# Altium project SiLPA_HE.PrjPCB (part 3 of 7)

## Sheet SiLPA_HE_RF_channel.SchDoc: SiLPA HE
size 420 x 297 mm; EDA_Number: ARTIQ; Projet: Sampler; Author: S.Hanasz / G. Kasprowicz; CompanyName: WUT ISE; DrawnBy: S.Hanasz / G. Kasprowicz; Organization: WUT ISE; Address1: PW ISE; Address2: Nowowiejska 15/19 00-665 Warsaw; Address3: gkasprow@gmail.com; DocumentNumber: 3; Revision: 1; SheetNumber: 3; SheetTotal: 9; ModifiedBy: -; CheckedDate: -; Title2: Power stage; DivGrp: WUT ISE; Designer: S.Hanasz / G. Kasprowicz; ModifiedDate: -; ProjectName: Sensor Box
Used 2 times, as channels U_SiLPA_RF_channel0, U_SiLPA_RF_channel1. Parts and nets are listed once, with the designators drawn on the sheet.
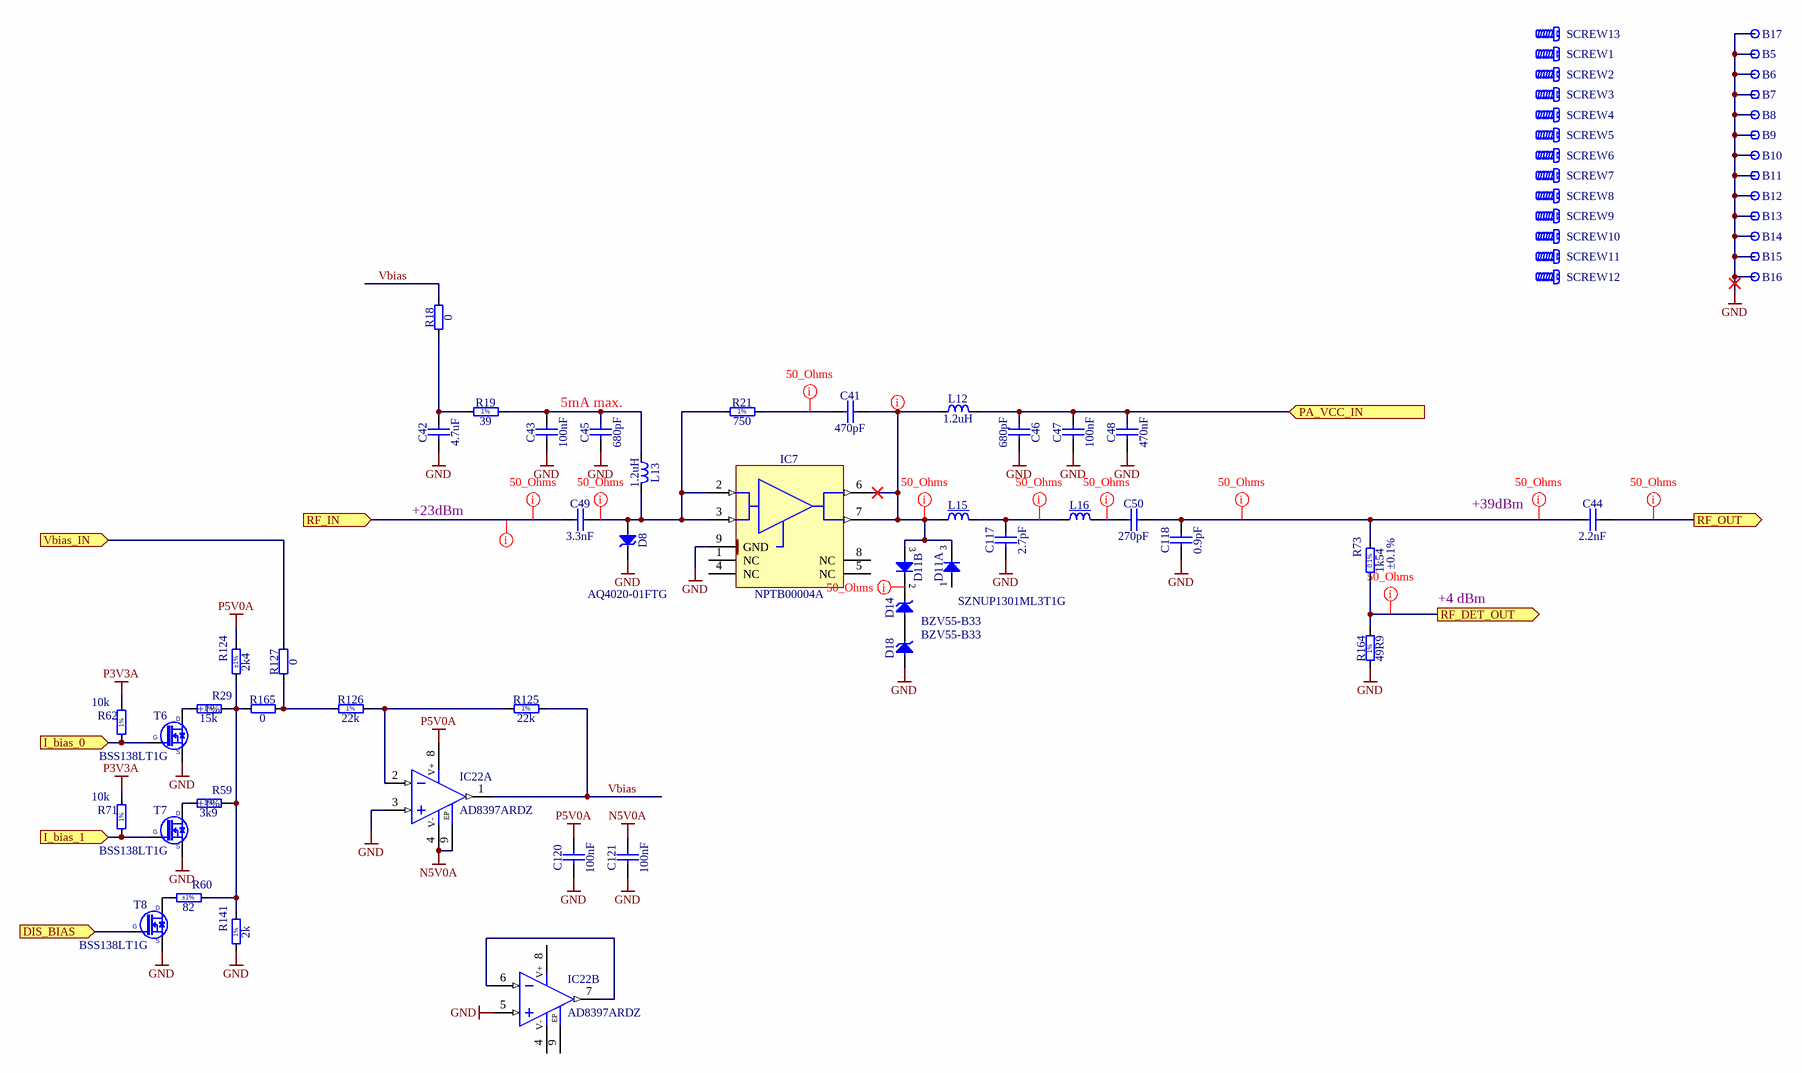
[diagram p3: SiLPA_HE_RF_channel.SchDoc]

### Parts
B5  Plated Hole  [MTG240_400]  (value not drawn)  (no BOM)
B6  Plated Hole  [MTG240_400]  (value not drawn)  (no BOM)
B7  Plated Hole  [MTG240_400]  (value not drawn)  (no BOM)
B8  Plated Hole  [MTG240_400]  (value not drawn)  (no BOM)
B9  Plated Hole  [MTG240_400]  (value not drawn)  (no BOM)
B10  Plated Hole  [MTG240_400]  (value not drawn)  (no BOM)
B11  Plated Hole  [MTG240_400]  (value not drawn)  (no BOM)
B12  Plated Hole  [MTG240_400]  (value not drawn)  (no BOM)
B13  Plated Hole  [MTG240_400]  (value not drawn)  (no BOM)
B14  Plated Hole  [MTG240_400]  (value not drawn)  (no BOM)
B15  Plated Hole  [MTG240_400]  (value not drawn)  (no BOM)
B16  Plated Hole  [MTG240_400]  (value not drawn)  (no BOM)
B17  Plated Hole  [MTG240_400]  (value not drawn)  (no BOM)
C41  470pF  [CAPC1608X87N]
C42  4.7uF  [CAPC1709X95N]
C43  100nF  [CAPC1005X55N]
C44  2.2nF  [CAPC1608X87N]
C45  680pF  [CAPC1005X55N]
C46  680pF  [CAPC1608X87N]
C47  100nF  [CAPC1005X55N]
C48  470nF  [CAPC2012X110N]
C49  3.3nF  [CAPC1608X87N]
C50  270pF  [CAPC1608X87N]
C117  2.7pF  [CAPC1608X87N]
C118  0.9pF  [CAPC1608X87N]
C120  100nF  [CAPC1005X55N]
C121  100nF  [CAPC1005X55N]
D8  AQ4020-01FTG  [SOD2512X110N]
D11  SZNUP1301ML3T1G  [SOT95P240X110-3N]  (value not drawn)  (parts A,B of 2)
D14  BZV55-B33  [DIOMELF3515N]
D18  BZV55-B33  [DIOMELF3515N]
IC7  NPTB00004A  [SOIC127P610X167-9N-R245X335]
IC22  AD8397ARDZ  [SOIC127P600X175-9N-R241X309]  (parts A,B of 2)
L12  1.2uH  [IND_TDK_ADL2012]
L13  1.2uH  [IND_TDK_ADL2012]
L15  (no value)  [IND_MURATA_LQW18AN_G8]
L16  (no value)  [IND_MURATA_LQW18AN_G8]
R18  0  [RESC1005X40N]
R19  39  [RESC1005X40N]
R21  750  [RESC1608X55N]
R29  15k  Tolerance: ±1%  [RESC1005X40N]
R59  3k9  Tolerance: ±1%  [RESC1005X40N]
R60  82  Tolerance: ±1%  [RESC1005X40N]
R62  10k  [RESC1005X40N]
R71  10k  [RESC1005X40N]
R73  1k54  Tolerance: ±0.1%  [RESC2012X60N]
R124  2k4  Tolerance: ±1%  [RESC1005X40N]
R125  22k  [RESC1005X40N]
R126  22k  [RESC1005X40N]
R127  0  [RESC1005X40N]
R141  2k  [RESC1005X40N]
R164  49R9  [RESC1608X55N]
R165  0  [RESC1005X40N]
SCREW1  (no value)  [BOSSARD_BN5687-3061579_v]
SCREW2  (no value)  [BOSSARD_BN5687-3061579_v]
SCREW3  (no value)  [BOSSARD_BN5687-3061579_v]
SCREW4  (no value)  [BOSSARD_BN5687-3061579_v]
SCREW5  (no value)  [BOSSARD_BN5687-3061579_v]
SCREW6  (no value)  [BOSSARD_BN5687-3061579_v]
SCREW7  (no value)  [BOSSARD_BN5687-3061579_v]
SCREW8  (no value)  [BOSSARD_BN5687-3061579_v]
SCREW9  (no value)  [BOSSARD_BN5687-3061579_v]
SCREW10  (no value)  [BOSSARD_BN5687-3061579_v]
SCREW11  (no value)  [BOSSARD_BN5687-3061579_v]
SCREW12  (no value)  [BOSSARD_BN5687-3061579_v]
SCREW13  (no value)  [BOSSARD_BN5687-3061579_v]
T6  BSS138LT1G  [SOT95P240X110-3N]
T7  BSS138LT1G  [SOT95P240X110-3N]
T8  BSS138LT1G  [SOT95P240X110-3N]

### Ports
DIS_BIAS (in), I_bias_0 (in), I_bias_1 (in), PA_VCC_IN (in), RF_DET_OUT (out), RF_IN (in), RF_OUT (out), Vbias_IN (in)

### Nets
GND: B5.1 B6.1 B7.1 B8.1 B9.1 B10.1 B11.1 B12.1 B13.1 B14.1 B15.1 B16.1 B17.1 C42.1 C43.1 C45.1 C46.1 C47.1 C48.1 C117.1 C118.1 C120.1 C121.1 D8.1(C) D18.2(A) IC7.9(GND) IC22.3(IN+) IC22.5(IN+) R141.1 R164.1 T6.2(S) T7.2(S) T8.2(S)
N5V0A: C121.2 IC22.4(V-) IC22.9(Exposed_Pad)
P3V3A: R62.2 R71.2
P5V0A: C120.2 IC22.8(V+) R124.2
DIS_BIAS: T8.1(G) ; port DIS_BIAS
I_bias_0: R62.1 T6.1(G) ; port I_bias_0
I_bias_1: R71.1 T7.1(G) ; port I_bias_1
PA_VCC_IN: C46.2 C47.2 C48.2 L12.2 ; port PA_VCC_IN
RF_DET_OUT: R73.1 R164.2 ; port RF_DET_OUT
RF_IN: C49.2 ; port RF_IN
RF_OUT: C44.2 ; port RF_OUT
Vbias: IC22.1(OUT) R18.2 R125.1
Vbias_IN: R127.2 ; port Vbias_IN
NetC41_1: C41.1 R21.2
NetC41_2: C41.2 D11.3(COMAC) IC7.6(RF_OUT) IC7.7(RF_OUT) L12.1 L15.1
NetC42_2: C42.2 R18.1 R19.1
NetC43_2: C43.2 C45.2 L13.1 R19.2
NetC44_1: C44.1 C50.2 C118.2 R73.2
NetC49_1: C49.1 D8.2(A) IC7.2(RF_IN) IC7.3(RF_IN) L13.2 R21.1
NetC50_1: C50.1 L16.2
NetC117_2: C117.2 L15.2 L16.1
NetD11_2: D11.2(C) D14.1(C)
NetD14_2: D14.2(A) D18.1(C)
NetIC22_2: IC22.2(IN-) R125.2 R126.1
NetIC22_6: IC22.6(IN-) IC22.7(OUT)
NetR29_1: R29.1 T6.3(D)
NetR29_2: R29.2 R59.2 R60.2 R124.1 R141.2 R165.1
NetR59_1: R59.1 T7.3(D)
NetR60_1: R60.1 T8.3(D)
NetR126_2: R126.2 R127.1 R165.2

Not connected (* = marked no-connect by the designer): D11 1(A); IC7 1(NC) 4(NC) 5(NC) 8(NC)

### Channels
U_SiLPA_RF_channel0: designators end in A; ports DIS_BIAS=NetIC24A_1 I_bias_0=I_bias0_0 I_bias_1=I_bias0_1 PA_VCC_IN=P25V0_0 RF_DET_OUT=NetC52A_1 RF_IN=NetC16A_2 RF_OUT=NetC44A_2 Vbias_IN=VBIAS_CTRL1
U_SiLPA_RF_channel1: designators end in B; ports DIS_BIAS=NetIC24A_1 I_bias_0=I_bias1_0 I_bias_1=I_bias1_1 PA_VCC_IN=P25V0_1 RF_DET_OUT=NetC52B_1 RF_IN=NetC16B_2 RF_OUT=NetC44B_2 Vbias_IN=VBIAS_CTRL2

### Layout directives
net class 50_Ohms: NetC16A_2, NetC41A_1, NetC41A_2, NetC44A_1, NetC44A_2, NetC49A_1, NetC50A_1, NetC52A_1, NetC117A_2, NetD11A_2
net class 50_Ohm: NetC16A_2, NetC41A_2

### Notes on the sheet
- 5mA max.
- +23dBm
- +39dBm
- +4 dBm
- Project/Equipment
- Document
- Designer
- Drawn by
- Check.by
- Copyright WUT ISE 2018.
  This documentation describes Open Hardware and is licensed under the CERN OHL v.1.1. You may redistribute and modify this documentation under the terms of the CERN OHL v.1.1. (http://ohwr.org/CERNOHL). This documentation is distributed WITHOUT ANY EXPRESS OR IMPLIED WARRANTY, INCLUDING OF MERCHANTABILITY, SATISFACTORY QUALITY AND FITNESS FOR A PARTICULAR PURPOSE. Please see the CERN OHL v.1.1 for applicable conditions.
- Contact
- File
- Last Mod.
- Print Date
- Sheet
- Size
- A3
- of
- Rev
- (in symbol AD8397ARDZ, part A) EP
- (in symbol AD8397ARDZ, part B) EP
- (in symbol R0402_2K_1%_0.0625W_100PPM) 1%
- (in symbol R0402_3K9_1%_0.0625W_100PPM) 1%
- (in symbol R0402_10K_1%_0.0625W_100PPM) 1%
- (in symbol R0402_15K_1%_0.0625W_100PPM) 1%
- (in symbol R0402_22K_1%_0.0625W_100PPM) 1%
- (in symbol R0402_39R_1%_0.0625W_100PPM) 1%
- (in symbol R0603_49K9_1%_0.1W_100PPM) 1%
- (in symbol R0603_750R_1%_0.1W_100PPM) 1%
- (in symbol R0805_1K54_0.1%_0.1W_10PPM) 0.1%

### Library data of the parts
B5-B17 = PLATED_HOLE2.4_PAD4.0: Single Terminal Socket; Part Description: Plated Through Hole: Hole Dia.=2.4mm Pad Dia.=4.0mm; Mounted: No; Part Number: PLATED_HOLE2.4_PAD4.0; Component Type: Standard (No BOM); Pin Count: 1; Family: Plated Hole; Socket: No; SMD: No; Status: None; ComponentHeight: 0mm; Author: CERN DEM JMW; CreateDate: 10.10.2011; LatestRevisionDate: 10.10.2011; PackageDescription: Plated Through Hole: Hole Dia.=2.4mm Pad Dia.=4.0mm; Sense: No; HelpURL: Undefined
C41 = CC0603_470PF_50V_1%_NP0: Non-polarised capacitor; Part Description: SMD Multilayer Chip Ceramic Capacitor; Manufacturer: GENERIC; Manufacturer1 Part Number: MCMT18N471F500CT; Voltage: 50V; TC: C0G/NP0; Tolerance: ±1%; Part Number: CC0603_470PF_50V_1%_NP0; Component Kind: Standard; Component Type: Standard; Pin Count: 2; Value: 470pF; Status: Preferred; Manufacturer Part Number: CC0603_470PF_50V_1%_NP0; Case: 0603; Mounted: Yes; Socket: No; SMD: Yes; Sense: No; Manufacturer1 Example: Multicomp; Manufacturer1 ComponentHeight: 0.87mm; HelpURL: \\cern.ch\dfs\Applications\Altium\Datasheets\CC0603_NP0_PHYCOMP.pdf; Author: GK; CreateDate: 03.12.2007; LatestRevisionDate: 03.12.2007
C42 = CC0603_4.7UF_16V_10%_X5R: Non-polarised capacitor; Manufacturer: GENERIC; Part Description: SMD Multilayer Chip Ceramic Capacitor; Manufacturer1 Part Number: EMK107ABJ475KA-T; Voltage: 16V; TC: X5R; Tolerance: ±10%; Value: 4.7uF; Manufacturer Part Number: CC0603_4.7UF_16V_10%_X5R; Part Number: CC0603_4.7UF_16V_10%_X5R; Component Kind: Standard; Component Type: Standard; Pin Count: 2; Status: None; Case: 0603; Mounted: Yes; Socket: No; SMD: Yes; Sense: No; Manufacturer1 Example: TAIYO YUDEN; Manufacturer1 ComponentHeight: 0.95mm; HelpURL: \\cern.ch\dfs\Applications\Altium\Datasheets\CC0603_X7R_TAIYO-YUDEN_HIGH-VALUE.pdf; Author: CERN DEM JLC; CreateDate: 16.12.2013; LatestRevisionDate: 16.09.2014
C43 C47 = CC0402_100NF_50V_10%_X7R: Non-polarised capacitor; Manufacturer: GENERIC; Part Description: SMD Multilayer Chip Ceramic Capacitor; Manufacturer1 Part Number: GRM155R71H104KE14D; Voltage: 50V; TC: X7R; Tolerance: ±10%; Value: 100nF; Manufacturer Part Number: CC0402_100NF_50V_10%_X7R; Part Number: CC0402_100NF_50V_10%_X7R; Component Kind: Standard; Component Type: Standard; Pin Count: 2; Status: None; Case: 0402; Mounted: Yes; Socket: No; SMD: Yes; Sense: No; Manufacturer1 Example: MURATA; Manufacturer1 ComponentHeight: 0.55mm; HelpURL: \\cern.ch\dfs\Applications\Altium\Datasheets\CC0402_MURATA_GRM155R71H104KE14D.pdf; Author: CERN DEM MR; CreateDate: 30/06/2017; LatestRevisionDate: 30/06/2017
C44 = CC0603_2.2NF_50V_5%_C0G: Non-polarised capacitor; Manufacturer: GENERIC; Part Description: SMD Multilayer Chip Ceramic Capacitor; Manufacturer1 Part Number: C1608C0G1H222J080AA; Voltage: 50V; TC: C0G/NP0; Tolerance: ±5%; Value: 2.2nF; Manufacturer Part Number: CC0603_2.2NF_50V_5%_C0G; Part Number: CC0603_2.2NF_50V_5%_C0G; Component Kind: Standard; Component Type: Standard; Pin Count: 2; Status: Preferred; Case: 0603; Mounted: Yes; Socket: No; SMD: Yes; Sense: No; Manufacturer1 Example: TDK; Manufacturer1 ComponentHeight: 0.9mm; HelpURL: \\cern.ch\dfs\Applications\Altium\Datasheets\CC0603_C0G_TDK_C.pdf; Author: CERN DEM JMW; CreateDate: 23.06.2014; LatestRevisionDate: 23.06.2014
C45 = CC0402_680PF_50V_5%_X7R: Non-polarised capacitor; Manufacturer: GENERIC; Manufacturer Part Number: CC0402_680PF_50V_10%_X7R; Part Description: SMD Multilayer Chip Ceramic Capacitor; Manufacturer1 Part Number: 223858715621; Voltage: 50V; TC: X7R; Tolerance: ±10%; Value: 680pF; Part Number: CC0402_680PF_50V_5%_X7R; Component Kind: Standard; Component Type: Standard; Pin Count: 2; Status: Not Recommended; Case: 0402; Mounted: Yes; Socket: No; SMD: Yes; Sense: No; Manufacturer1 Example: PHYCOMP; Manufacturer1 ComponentHeight: 0.55mm; HelpURL: \\cern.ch\dfs\Applications\Altium\Datasheets\CC0402_NP0_PHYCOMP.pdf; Author: CERN DEM JLC; CreateDate: 03.12.2007; LatestRevisionDate: 03.12.2007
C46 = CC0603_680PF_50V_5%_NP0: Non-polarised capacitor; Manufacturer: GENERIC; Part Description: SMD Multilayer Chip Ceramic Capacitor; Manufacturer1 Part Number: 223886715681; Voltage: 50V; TC: C0G/NP0; Tolerance: ±5%; Value: 680pF; Manufacturer Part Number: CC0603_680PF_50V_5%_NP0; Part Number: CC0603_680PF_50V_5%_NP0; Component Kind: Standard; Component Type: Standard; Pin Count: 2; Status: Preferred; Case: 0603; Mounted: Yes; Socket: No; SMD: Yes; Sense: No; Manufacturer1 Example: PHYCOMP; Manufacturer1 ComponentHeight: 0.87mm; HelpURL: \\cern.ch\dfs\Applications\Altium\Datasheets\CC0603_NP0_PHYCOMP.pdf; Author: CERN DEM JLC; CreateDate: 03.12.2007; LatestRevisionDate: 03.12.2007
C48 = CC0805_470NF_50V_10%_X7R: Non-polarised capacitor; Part Description: SMD Multilayer Chip Ceramic Capacitor; Manufacturer: GENERIC; Manufacturer1 Part Number: C0805C474K5RACTU; Voltage: 50V; TC: X7R; Tolerance: ±10%; Part Number: CC0805_470NF_50V_10%_X7R; Component Kind: Standard; Component Type: Standard; Pin Count: 2; Value: 470nF; Status: Preferred; Manufacturer Part Number: CC0805_470NF_50V_10%_X7R; Case: 0805; Mounted: Yes; Socket: No; SMD: Yes; Sense: No; Manufacturer1 Example: KEMET; Manufacturer1 ComponentHeight: 1.1mm; HelpURL: \\cern.ch\dfs\Applications\Altium\Datasheets\CC0805_X7R_KEMET.pdf; Author: CERN DEM JLC; CreateDate: 04.12.2013; LatestRevisionDate: 04.12.2013
C49 = CC0603_3.3NF_50V_5%_C0G: Non-polarised capacitor; Manufacturer: GENERIC; Part Description: SMD Multilayer Chip Ceramic Capacitor; Manufacturer1 Part Number: C1608C0G1H332J080AA; Voltage: 50V; TC: C0G/NP0; Tolerance: ±5%; Value: 3.3nF; Manufacturer Part Number: CC0603_3.3NF_50V_5%_C0G; Part Number: CC0603_3.3NF_50V_5%_C0G; Component Kind: Standard; Component Type: Standard; Pin Count: 2; Status: Preferred; Case: 0603; Mounted: Yes; Socket: No; SMD: Yes; Sense: No; Manufacturer1 Example: TDK; Manufacturer1 ComponentHeight: 0.9mm; HelpURL: \\cern.ch\dfs\Applications\Altium\Datasheets\CC0603_C0G_TDK_C.pdf; Author: CERN DEM MR; CreateDate: 02.11.2016; LatestRevisionDate: 02.11.2016
C50 = CC0603_270PF_50V_1%_NP0: Non-polarised capacitor; Part Description: SMD Multilayer Chip Ceramic Capacitor; Manufacturer: GENERIC; Manufacturer1 Part Number: C0603C271F5GACTU; Voltage: 50V; TC: C0G/NP0; Tolerance: ±1%; Part Number: CC0603_270PF_50V_1%_NP0; Component Kind: Standard; Component Type: Standard; Pin Count: 2; Value: 270pF; Status: Preferred; Manufacturer Part Number: CC0603_270PF_50V_1%_NP0; Case: 0603; Mounted: Yes; Socket: No; SMD: Yes; Sense: No; Manufacturer1 Example: Kemet; Manufacturer1 ComponentHeight: 0.87mm; HelpURL: \\cern.ch\dfs\Applications\Altium\Datasheets\CC0603_NP0_PHYCOMP.pdf; Author: GK; CreateDate: 03.12.2007; LatestRevisionDate: 03.12.2007
C117 = CC0603_2.7PF_50V_0.25PF_NP0: Non-polarised capacitor; Part Description: SMD Multilayer Chip Ceramic Capacitor; Manufacturer: GENERIC; Manufacturer1 Part Number: 223886715278; Voltage: 50V; TC: C0G/NP0; Tolerance: ±0.25pF; Part Number: CC0603_2.7PF_50V_0.25PF_NP0; Component Kind: Standard; Component Type: Standard; Pin Count: 2; Value: 2.7pF; Status: Preferred; Manufacturer Part Number: CC0603_2.7PF_50V_0.25PF_NP0; Case: 0603; Mounted: Yes; Socket: No; SMD: Yes; Sense: No; Manufacturer1 Example: PHYCOMP; Manufacturer1 ComponentHeight: 0.87mm; HelpURL: \\cern.ch\dfs\Applications\Altium\Datasheets\CC0603_NP0_PHYCOMP.pdf; Author: CERN DEM JLC; CreateDate: 03.12.2007; LatestRevisionDate: 03.12.2007
C118 = CC0603_0.9PF_50V_0.05PF_NP0: Non-polarised capacitor; Part Description: SMD Multilayer Chip Ceramic Capacitor; Manufacturer: GENERIC; Manufacturer1 Part Number: ML03510R9AAT2A; Voltage: 50V; TC: C0G/NP0; Tolerance: ±0.05pF; Part Number: CC0603_0.9PF_50V_0.05PF_NP0; Component Kind: Standard; Component Type: Standard; Pin Count: 2; Value: 0.9pF; Status: Preferred; Manufacturer Part Number: CC0603_0.9PF_50V_0.05PF_NP0; Case: 0603; Mounted: Yes; Socket: No; SMD: Yes; Sense: No; Manufacturer1 Example: AVX; Manufacturer1 ComponentHeight: 0.87mm; HelpURL: \\cern.ch\dfs\Applications\Altium\Datasheets\CC0603_NP0_PHYCOMP.pdf; Author: GK; CreateDate: 03.12.2007; LatestRevisionDate: 03.12.2007
C120 C121 = CC0402_100NF_50V_10%_X7R: as C103 on sheet SiLPA_HE_EEM_Connectors; Part Number: CC0402_100NF_50V_10%_X7R; Component Kind: Standard; Component Type: Standard; Pin Count: 2; Value: 100nF; Status: None; Manufacturer Part Number: CC0402_100NF_50V_10%_X7R; Case: 0402; Mounted: Yes; Socket: No; SMD: Yes; Sense: No; Manufacturer1 Example: MURATA; Manufacturer1 ComponentHeight: 0.55mm; HelpURL: \\cern.ch\dfs\Applications\Altium\Datasheets\CC0402_MURATA_GRM155R71H104KE14D.pdf; Author: CERN DEM MR; CreateDate: 30.06.2017; LatestRevisionDate: 30.06.2017
D8 = D_TVS_AQ4020-01FTG: 4V Transient Voltage Suppressor Diode (Uni-Directional); Part Description: Unidirectional ESD Protection for Transient Voltage Suppression; Manufacturer: Littlefuse; Power: 735W; PressFit: No; Bonding: No; Part Number: AQ4020-01FTG; Component Kind: Standard; Component Type: Standard; Device: AQ4020-01FTG; PackageDescription: Small Outline Diode (SOD-323), 1.70mm W X 1.25mm L X 1.10mm H body,  IPC Medium Density; Voltage: 4V; Manufacturer Part Number: AQ4020-01FTG; Pin Count: 2; Case: SOD323; Mounted: Yes; Socket: No; SMD: Yes; Sense: No; ComponentHeight: 1.1mm; HelpURL: \\cern.ch\dfs\Applications\Altium\Datasheets\PESD5V0S1UA.pdf; Author: GK; CreateDate: 28.08.2012; LatestRevisionDate: 18.09.2013
D11 = D_TVS_SZNUP1301ML3T1G: Low Capacitance Diode Array for ESD Protection in a Single Data Line; Manufacturer: ONSEMI; Voltage: 70V; Power: 215mA; PressFit: No; Bonding: No; Part Number: SZNUP1301ML3T1G; Component Kind: Standard; Component Type: Standard; Device: SZNUP1301ML3T1G; PackageDescription: SOT23 3-Leads, Pitch 0.95mm - Body 1.3x2.9mm, IPC Medium Density; Part Description: Low Capacitance Diode Array for ESD Protection in a Single Data Line; Manufacturer Part Number: SZNUP1301ML3T1G; Pin Count: 3; Case: SOT23; Mounted: Yes; Socket: No; SMD: Yes; Sense: No; ComponentHeight: 1.1mm; HelpURL: \\cern.ch\dfs\Applications\Altium\Datasheets\BAR66.pdf; Author: GK; CreateDate: 18.01.2010; LatestRevisionDate: 05.10.2010
D14 D18 = BZV55-B33: Zener Diode; Part Description: Voltage Regulator Diode; Manufacturer: NEXPERIA; Voltage: 33V; Power: 500mW; PressFit: No; Bonding: No; Part Number: BZV55-B33; Component Kind: Standard; Component Type: Standard; Device: BZV55-B33; PackageDescription: SOD80C, MELF Diode, 2-Leads, Body 3.5x1.5mm, IPC Medium Density; Manufacturer Part Number: BZV55-B33; Pin Count: 2; Case: SOD-80C; Mounted: Yes; Socket: No; SMD: Yes; Sense: No; ComponentHeight: 1.6mm; HelpURL: \\cern.ch\dfs\Applications\Altium\Datasheets\BZV55.pdf; Author: CERN DEM JLC; CreateDate: 25.07.2012; LatestRevisionDate: 22.01.2018
IC7 = NPTB00004A: GaN Wideband Transistor 28V, 5W, DC - 6GHz; Manufacturer: MACOM; PressFit: No; Bonding: No; Part Number: NPTB00004A; Component Kind: Standard; Component Type: Standard; Device: NPTB00004A; PackageDescription: SOIC, 1.27mm pitch; 8 pin, 3.89mm W X 4.90mm L X 1.67mm H body (w/thermal tab 2.45mm X 3.35mm), IPC Medium Density; Part Description: GaN Wideband Transistor 28V, 5W, DC - 6GHz; Manufacturer Part Number: NPTB00004A; Pin Count: 9; Case: SOIC8; Mounted: Yes; Socket: No; SMD: Yes; Sense: No; ComponentHeight: 1.67mm; Author: CERN DEM BC; HelpURL: \\cern.ch\dfs\Applications\Altium\Datasheets\NPTB00004A.pdf; CreateDate: 23.08.2019; LatestRevisionDate: 23.08.2019
IC22 = AD8397ARDZ: Dual Operational Amplifier With Exposed Pad; Part Description: Rail-to-Rail, High Output Current Amplifier; Manufacturer: ANALOG DEVICES; PressFit: No; Bonding: No; Part Number: AD8397ARDZ; Component Kind: Standard; Component Type: Standard; Device: AD8397ARDZ; PackageDescription: SOIC 8, Pitch 1.27mm - Body 3.9x4.9mm, (w/thermal tab 2.41mm X 3.098mm), IPC Medium Density; Manufacturer Part Number: AD8397ARDZ; Pin Count: 9; Case: SOIC8; Mounted: Yes; Socket: No; SMD: Yes; Sense: No; ComponentHeight: 1.75mm; Author: CERN DEM JLC; HelpURL: \\cern.ch\dfs\Applications\Altium\Datasheets\AD8397ARDZ.pdf; CreateDate: 31.05.2011; LatestRevisionDate: 31.05.2011
L12 L13 = IND0805_TDK_ADL2012S-1R2M-T01: Inductor; Part Description: SMD Wirewound; Manufacturer: TDK; Power: 400mA; Resistance: 0.5Ohm; Tolerance: ±20%; Part Number: IND0805_TDK_ADL2012S-1R2M-T01; Component Kind: Standard; Component Type: Standard; Footprint: INDC2013X145N; Pin Count: 2; Value: 1.2uH; Manufacturer Part Number: ADL2012S-1R2M-T01; Case: 0805; Mounted: Yes; Socket: No; SMD: Yes; Sense: No; ComponentHeight: 1.45mm; HelpURL: \\cern.ch\dfs\Applications\Altium\Datasheets\IND0805_TDK_MLZ2012P220WT000.pdf; Author: GK; CreateDate: 24.03.2020; LatestRevisionDate: 24.03.2020
L15 = IND0603_4.7NH_2%_MURATA_LQW18AN4N7G8Z: Inductor With Core; Part Description: Wirw Wond RF Inductor For Automotive; Manufacturer: MURATA; Value: 4.7nH; Power: 1.5A; Resistance: 0R054; Tolerance: ±2%; Part Number: IND0603_4.7NH_2%_MURATA_LQW18AN4N7G8Z; Component Kind: Standard; Component Type: Standard; Pin Count: 2; Status: None; Manufacturer Part Number: LQW18AN4N7G8Z; Case: 0603; Mounted: Yes; Socket: No; SMD: Yes; Sense: No; ComponentHeight: 1mm; HelpURL: \\cern.ch\dfs\Applications\Altium\Datasheets\IND_MURATA_LQW18AN4N7G8Z.pdf; Author: CERN DEM BC; CreateDate: 26.08.2019; LatestRevisionDate: 26.08.2019
L16 = IND0603_6.8NH_2%_MURATA_LQW18AN6N8G8Z: Inductor With Core; Part Description: Wirw Wond RF Inductor For Automotive; Manufacturer: MURATA; Value: 6.8nH; Power: 1.9A; Resistance: 0R04; Tolerance: ±2%; Part Number: IND0603_6.8NH_2%_MURATA_LQW18AN6N8G8Z; Component Kind: Standard; Component Type: Standard; Pin Count: 2; Status: None; Manufacturer Part Number: LQW18AN6N8G8Z; Case: 0603; Mounted: Yes; Socket: No; SMD: Yes; Sense: No; ComponentHeight: 1mm; HelpURL: \\cern.ch\dfs\Applications\Altium\Datasheets\IND_MURATA_LQW18AN6N8G8Z.pdf; Author: CERN DEM BC; CreateDate: 26.08.2019; LatestRevisionDate: 26.08.2019
R18 R127 R165 = R0402_0R_JUMPER: Resistor; Manufacturer: GENERIC; Part Description: 1A (0.05R Max DC Resistance) Zero Ohm Jumper; Manufacturer1 Part Number: 232270591001L; PressFit: No; Value: 0; Manufacturer Part Number: R0402_0R_JUMPER; Part Number: R0402_0R_JUMPER; Component Kind: Standard; Component Type: Standard; Pin Count: 2; Status: Not Recommended; Case: 0402; Mounted: Yes; Sense: No; Socket: No; SMD: Yes; Manufacturer1 Example: YAGEO PHYCOMP; Manufacturer1 ComponentHeight: 0.4mm; HelpURL: \\cern.ch\dfs\Applications\Altium\Datasheets\R0402_Phycomp_RC0402.pdf; Author: CERN DEM JLC; CreateDate: 03.12.2007; LatestRevisionDate: 17.10.2012
R19 = R0402_39R_1%_0.0625W_100PPM: Resistor - 1%; Part Description: General Purpose Thick Film Chip Resistor; Manufacturer: GENERIC; Manufacturer1 Part Number: 232270673909L; TC: ±100ppm/°C; PressFit: No; Part Number: R0402_39R_1%_0.0625W_100PPM; Component Kind: Standard; Component Type: Standard; Pin Count: 2; Value: 39; Status: Not Recommended; Power: 0.0625W; Tolerance: ±1%; Manufacturer Part Number: R0402_39R_1%_0.0625W_100PPM; Case: 0402; Mounted: Yes; Sense: No; Socket: No; SMD: Yes; Manufacturer1 Example: YAGEO PHYCOMP; Manufacturer1 ComponentHeight: 0.4mm; HelpURL: \\cern.ch\dfs\Applications\Altium\Datasheets\R0402_Phycomp_RC0402.pdf; Author: CERN DEM JLC; CreateDate: 03.12.2007; LatestRevisionDate: 17.10.2012
R21 = R0603_750R_1%_0.1W_100PPM: Resistor - 1%; Part Description: General Purpose Thick Film Chip Resistor; Manufacturer: GENERIC; Manufacturer1 Part Number: NRC06F7500TRF; Power: 0.1W; TC: ±100ppm/°C; PressFit: No; Part Number: R0603_750R_1%_0.1W_100PPM; Component Kind: Standard; Component Type: Standard; Pin Count: 2; Value: 750; Status: Preferred; Tolerance: ±1%; Manufacturer Part Number: R0603_750R_1%_0.1W_100PPM; Case: 0603; Mounted: Yes; Sense: No; Socket: No; SMD: Yes; Manufacturer1 Example: NIC COMPONENT; Manufacturer1 ComponentHeight: 0.55mm; HelpURL: \\cern.ch\dfs\Applications\Altium\Datasheets\R0603_NIC_NRC.pdf; Author: CERN DEM JLC; CreateDate: 03.12.2007; LatestRevisionDate: 13.03.2008
R29 = R0402_15K_1%_0.0625W_100PPM: Resistor - 1%; Part Description: General Purpose Thick Film Chip Resistor; Manufacturer: GENERIC; Manufacturer1 Part Number: CRCW040215K0FKED; TC: ±100ppm/°C; PressFit: No; Part Number: R0402_15K_1%_0.0625W_100PPM; Component Kind: Standard; Component Type: Standard; Pin Count: 2; Value: 15k; Status: None; Power: 0.0625W; Manufacturer Part Number: R0402_15K_1%_0.0625W_100PPM; Case: 0402; Mounted: Yes; Sense: No; Socket: No; SMD: Yes; Manufacturer1 Example: VISHAY; Manufacturer1 ComponentHeight: 0.4mm; HelpURL: \\cern.ch\dfs\Applications\Altium\Datasheets\R0402_VISHAY_CRCW e3.pdf; Author: CERN DEM JMW; CreateDate: 06.07.2015; LatestRevisionDate: 06.07.2015
R59 = R0402_3K9_1%_0.0625W_100PPM: as R81 on sheet SiLPA_HE_PWR_Supply; Part Number: R0402_3K9_1%_0.0625W_100PPM; Component Kind: Standard; Component Type: Standard; Pin Count: 2; Value: 3k9; Status: Not Recommended; Power: 0.0625W; Manufacturer Part Number: R0402_3K9_1%_0.0625W_100PPM; Case: 0402; Mounted: Yes; Sense: No; Socket: No; SMD: Yes; Manufacturer1 Example: YAGEO PHYCOMP; Manufacturer1 ComponentHeight: 0.4mm; HelpURL: \\cern.ch\dfs\Applications\Altium\Datasheets\R0402_Phycomp_RC0402.pdf; Author: CERN DEM JLC; CreateDate: 03.12.2007; LatestRevisionDate: 17.10.2012
R60 = R0402_82R_1%_0.0625W_100PPM: Resistor - 1%; Part Description: General Purpose Thick Film Chip Resistor; Manufacturer: GENERIC; Manufacturer1 Part Number: 232270678209L; TC: ±100ppm/°C; PressFit: No; Part Number: R0402_82R_1%_0.0625W_100PPM; Component Kind: Standard; Component Type: Standard; Pin Count: 2; Value: 82; Status: Not Recommended; Power: 0.0625W; Manufacturer Part Number: R0402_82R_1%_0.0625W_100PPM; Case: 0402; Mounted: Yes; Sense: No; Socket: No; SMD: Yes; Manufacturer1 Example: YAGEO PHYCOMP; Manufacturer1 ComponentHeight: 0.4mm; HelpURL: \\cern.ch\dfs\Applications\Altium\Datasheets\R0402_Phycomp_RC0402.pdf; Author: CERN DEM JLC; CreateDate: 03.12.2007; LatestRevisionDate: 17.10.2012
R62 R71 = R0402_10K_1%_0.0625W_100PPM: as R20 on sheet SiLPA_HE; Part Number: R0402_10K_1%_0.0625W_100PPM; Component Kind: Standard; Component Type: Standard; Pin Count: 2; Value: 10k; Status: Not recommended; Power: 0.0625W; Tolerance: ±1%; Manufacturer Part Number: R0402_10K_1%_0.0625W_100PPM; Case: 0402; Mounted: Yes; Socket: No; SMD: Yes; Manufacturer1 Example: YAGEO PHYCOMP; Manufacturer1 ComponentHeight: 0.4mm; HelpURL: \\cern.ch\dfs\Applications\Altium\Datasheets\R0402_Phycomp_RC0402.pdf; Author: CERN DEM JLC; CreateDate: 2007-12-03; LatestRevisionDate: 2012-10-17
R73 = R0805_1K54_0.1%_0.1W_10PPM: Resistor - 0.1%; Part Description: Thin Film Chip Resistor; Manufacturer: GENERIC; Manufacturer1 Part Number: RN73C2A1K54BTG; Power: 0.1W; TC: ±10ppm; PressFit: No; Part Number: R0805_1K54_0.1%_0.1W_10PPM; Component Kind: Standard; Component Type: Standard; Pin Count: 2; Value: 1k54; Status: Not Recommended; Manufacturer Part Number: R0805_1K54_0.1%_0.1W_10PPM; Case: 0805; Mounted: Yes; Sense: No; Socket: No; SMD: Yes; Manufacturer1 Example: TYCO HOLSWORTHY; Manufacturer1 ComponentHeight: 0.6mm; HelpURL: \\cern.ch\dfs\Applications\Altium\Datasheets\R0805_Tyco_RN73.pdf; Author: CERN DEM JLC; CreateDate: 03.12.2007; LatestRevisionDate: 13.03.2008
R124 = R0402_2K4_1%_0.0625W_100PPM: Resistor - 1%; Part Description: General Purpose Thick Film Chip Resistor; Manufacturer: GENERIC; Manufacturer1 Part Number: 232270672402L; TC: ±100ppm/°C; PressFit: No; Part Number: R0402_2K4_1%_0.0625W_100PPM; Component Kind: Standard; Component Type: Standard; Pin Count: 2; Value: 2k4; Status: Not Recommended; Power: 0.0625W; Manufacturer Part Number: R0402_2K4_1%_0.0625W_100PPM; Case: 0402; Mounted: Yes; Sense: No; Socket: No; SMD: Yes; Manufacturer1 Example: YAGEO PHYCOMP; Manufacturer1 ComponentHeight: 0.4mm; HelpURL: \\cern.ch\dfs\Applications\Altium\Datasheets\R0402_Phycomp_RC0402.pdf; Author: CERN DEM JLC; CreateDate: 03.12.2007; LatestRevisionDate: 17.10.2012
R125 R126 = R0402_22K_1%_0.0625W_100PPM: as R58 on sheet SiLPA_HE_PWR_Supply; Part Number: R0402_22K_1%_0.0625W_100PPM; Component Kind: Standard; Component Type: Standard; Pin Count: 2; Value: 22k; Status: Not Recommended; Power: 0.0625W; Tolerance: ±1%; Manufacturer Part Number: R0402_22K_1%_0.0625W_100PPM; Case: 0402; Mounted: Yes; Sense: No; Socket: No; SMD: Yes; Manufacturer1 Example: YAGEO PHYCOMP; Manufacturer1 ComponentHeight: 0.4mm; HelpURL: \\cern.ch\dfs\Applications\Altium\Datasheets\R0402_Phycomp_RC0402.pdf; Author: CERN DEM JLC; CreateDate: 03.12.2007; LatestRevisionDate: 17.10.2012
R141 = R0402_2K_1%_0.0625W_100PPM: Resistor - 1%; Part Description: General Purpose Thick Film Chip Resistor; Manufacturer: GENERIC; Manufacturer1 Part Number: 232270672002L; TC: ±100ppm/°C; PressFit: No; Tolerance: ±1%; Part Number: R0402_2K_1%_0.0625W_100PPM; Component Kind: Standard; Component Type: Standard; Pin Count: 2; Value: 2k; Status: Not Recommended; Power: 0.0625W; Manufacturer Part Number: R0402_2K_1%_0.0625W_100PPM; Case: 0402; Mounted: Yes; Sense: No; Socket: No; SMD: Yes; Manufacturer1 Example: YAGEO PHYCOMP; Manufacturer1 ComponentHeight: 0.4mm; HelpURL: \\cern.ch\dfs\Applications\Altium\Datasheets\R0402_Phycomp_RC0402.pdf; Author: CERN DEM JLC; CreateDate: 03.12.2007; LatestRevisionDate: 17.10.2012
R164 = R0603_49K9_1%_0.1W_100PPM: as R17 on sheet SiLPA_HE_PWR_Supply; Part Number: R0603_49K9_1%_0.1W_100PPM; Component Kind: Standard; Component Type: Standard; Pin Count: 2; Value: 49R9; Status: Preferred; Tolerance: ±1%; Case: 0603; Mounted: Yes; Sense: No; Socket: No; SMD: Yes; Manufacturer1 Example: VISHAY; Manufacturer1 ComponentHeight: 0.55mm; HelpURL: \\cern.ch\dfs\Applications\Altium\Datasheets\R0603_VISHAY_CRCW e3.pdf; Author: CERN DEM JLC; CreateDate: 16.11.2017; LatestRevisionDate: 16.11.2017
SCREW1-SCREW13 = BOSSARD_BN5687-3061579_v: Screw; Part Description: M2 L=4mm Hexalobular Socket Pan Head Screw, Fully Threaded, Stainless Steel A2; Manufacturer Part Number: BN5687 Art.3061579; PressFit: No; Value: M2x4; Part Number: BOSSARD_BN5687-3061579_v; Component Kind: Standard; Component Type: Mechanical; Pin Count: 0; PackageDescription: M2 L=4mm Hexalobular Socket Pan Head Screw, Fully Threaded - Stainless Steel A2; Mounted: Yes; Socket: No; SMD: No; Sense: No; Status: None; Manufacturer: BOSSARD; ComponentHeight: 5.6mm; HelpURL: \\cern.ch\dfs\Applications\Altium\Datasheets\BOSSARD_BN5687-3061579.pdf; Author: CERN DEM JLC; CreateDate: 01.11.2018; LatestRevisionDate: 01.11.2018
T6-T8 = BSS138LT1G: as T17 on sheet SiLPA_HE_EEM_Connectors; Part Number: BSS138LT1G; Component Kind: Standard; Component Type: Standard; Device: BSS138LT1G; PackageDescription: SOT23, 0.95mm Pitch; 3 Pin, 1.40mm W X 3.00mm L X 1.10mm H body, IPC Medium Density; Manufacturer Part Number: BSS138LT1G; Pin Count: 3; Case: SOT23-3; Mounted: Yes; Socket: No; SMD: Yes; Sense: No; ComponentHeight: 1.11mm; HelpURL: \\cern.ch\dfs\Applications\Altium\Datasheets\BSS138LT1G.pdf; Author: CERN DEM JLC; CreateDate: 23.03.2009; LatestRevisionDate: 23.03.2009